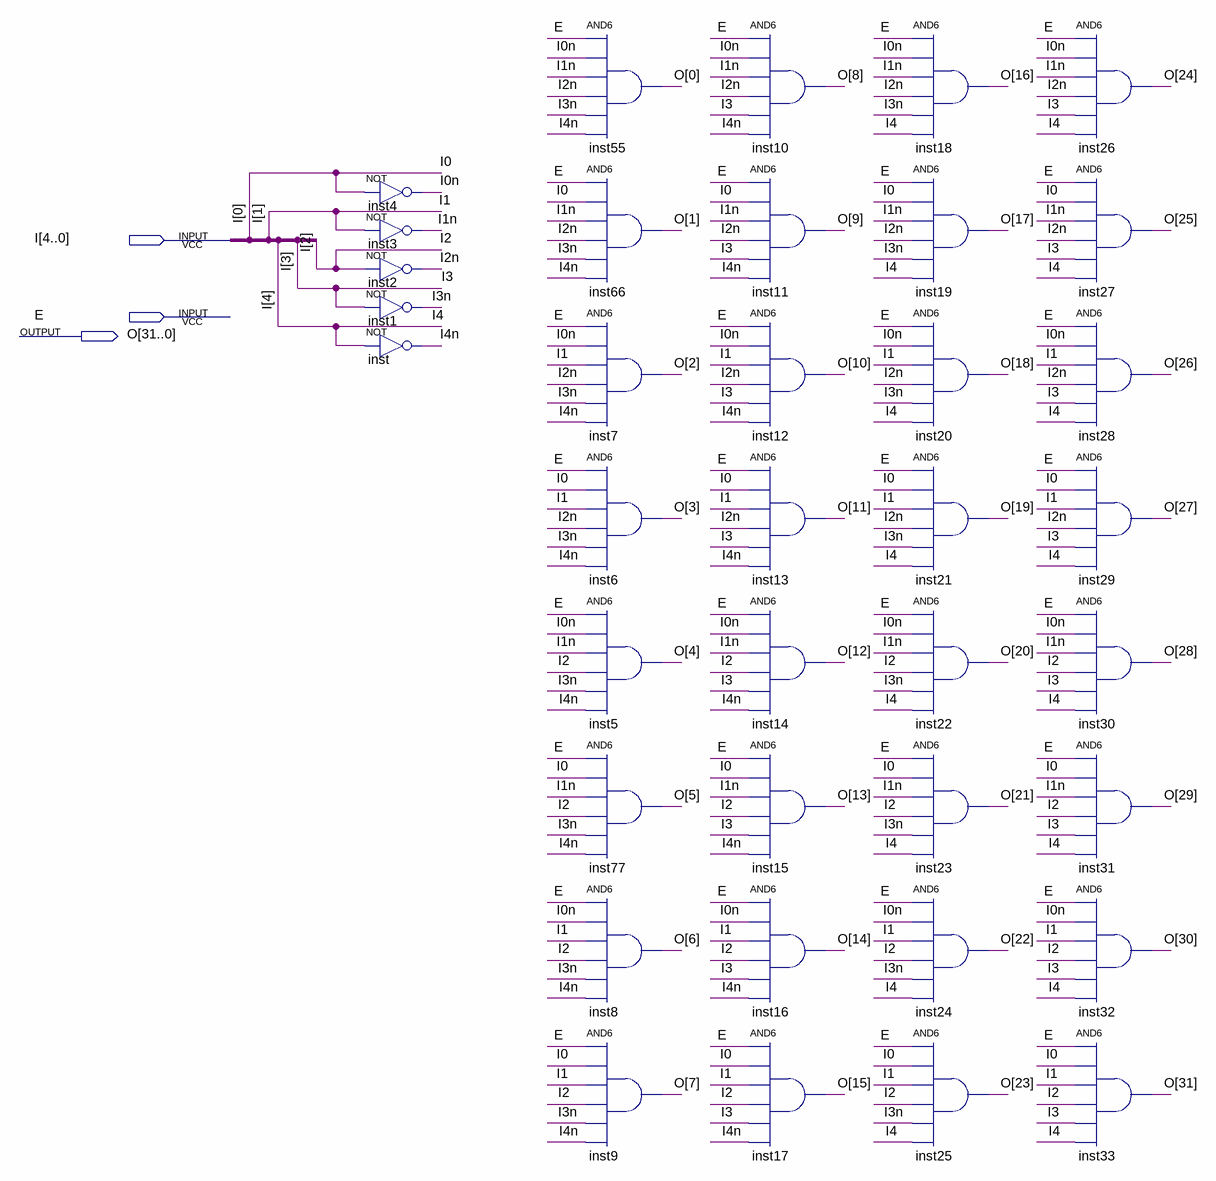
[diagram p0: schematic sheet]
// Quartus schematic decoder_5to32.bdf as structural Verilog: 37 symbols, 3 pins
module decoder_5to32 (
  input  [4:0] I,
  input  E,
  output [31:0] O
);

  wire I0n, I1n, I2n, I3n, I4n;

  not inst4 (I0n, I[0]);
  not inst3 (I1n, I[1]);
  not inst2 (I2n, I[2]);
  not inst1 (I3n, I[3]);
  not inst (I4n, I[4]);
  and inst55 (O[0], E, I0n, I1n, I2n, I3n, I4n);
  and inst66 (O[1], E, I[0], I1n, I2n, I3n, I4n);
  and inst7 (O[2], E, I0n, I[1], I2n, I3n, I4n);
  and inst6 (O[3], E, I[0], I[1], I2n, I3n, I4n);
  and inst5 (O[4], E, I0n, I1n, I[2], I3n, I4n);
  and inst77 (O[5], E, I[0], I1n, I[2], I3n, I4n);
  and inst8 (O[6], E, I0n, I[1], I[2], I3n, I4n);
  and inst9 (O[7], E, I[0], I[1], I[2], I3n, I4n);
  and inst10 (O[8], E, I0n, I1n, I2n, I[3], I4n);
  and inst11 (O[9], E, I[0], I1n, I2n, I[3], I4n);
  and inst12 (O[10], E, I0n, I[1], I2n, I[3], I4n);
  and inst13 (O[11], E, I[0], I[1], I2n, I[3], I4n);
  and inst14 (O[12], E, I0n, I1n, I[2], I[3], I4n);
  and inst15 (O[13], E, I[0], I1n, I[2], I[3], I4n);
  and inst16 (O[14], E, I0n, I[1], I[2], I[3], I4n);
  and inst17 (O[15], E, I[0], I[1], I[2], I[3], I4n);
  and inst18 (O[16], E, I0n, I1n, I2n, I3n, I[4]);
  and inst19 (O[17], E, I[0], I1n, I2n, I3n, I[4]);
  and inst20 (O[18], E, I0n, I[1], I2n, I3n, I[4]);
  and inst21 (O[19], E, I[0], I[1], I2n, I3n, I[4]);
  and inst22 (O[20], E, I0n, I1n, I[2], I3n, I[4]);
  and inst23 (O[21], E, I[0], I1n, I[2], I3n, I[4]);
  and inst24 (O[22], E, I0n, I[1], I[2], I3n, I[4]);
  and inst25 (O[23], E, I[0], I[1], I[2], I3n, I[4]);
  and inst26 (O[24], E, I0n, I1n, I2n, I[3], I[4]);
  and inst27 (O[25], E, I[0], I1n, I2n, I[3], I[4]);
  and inst28 (O[26], E, I0n, I[1], I2n, I[3], I[4]);
  and inst29 (O[27], E, I[0], I[1], I2n, I[3], I[4]);
  and inst30 (O[28], E, I0n, I1n, I[2], I[3], I[4]);
  and inst31 (O[29], E, I[0], I1n, I[2], I[3], I[4]);
  and inst32 (O[30], E, I0n, I[1], I[2], I[3], I[4]);
  and inst33 (O[31], E, I[0], I[1], I[2], I[3], I[4]);
endmodule
